# Altium project PhotodiodeBoard.PrjPCB
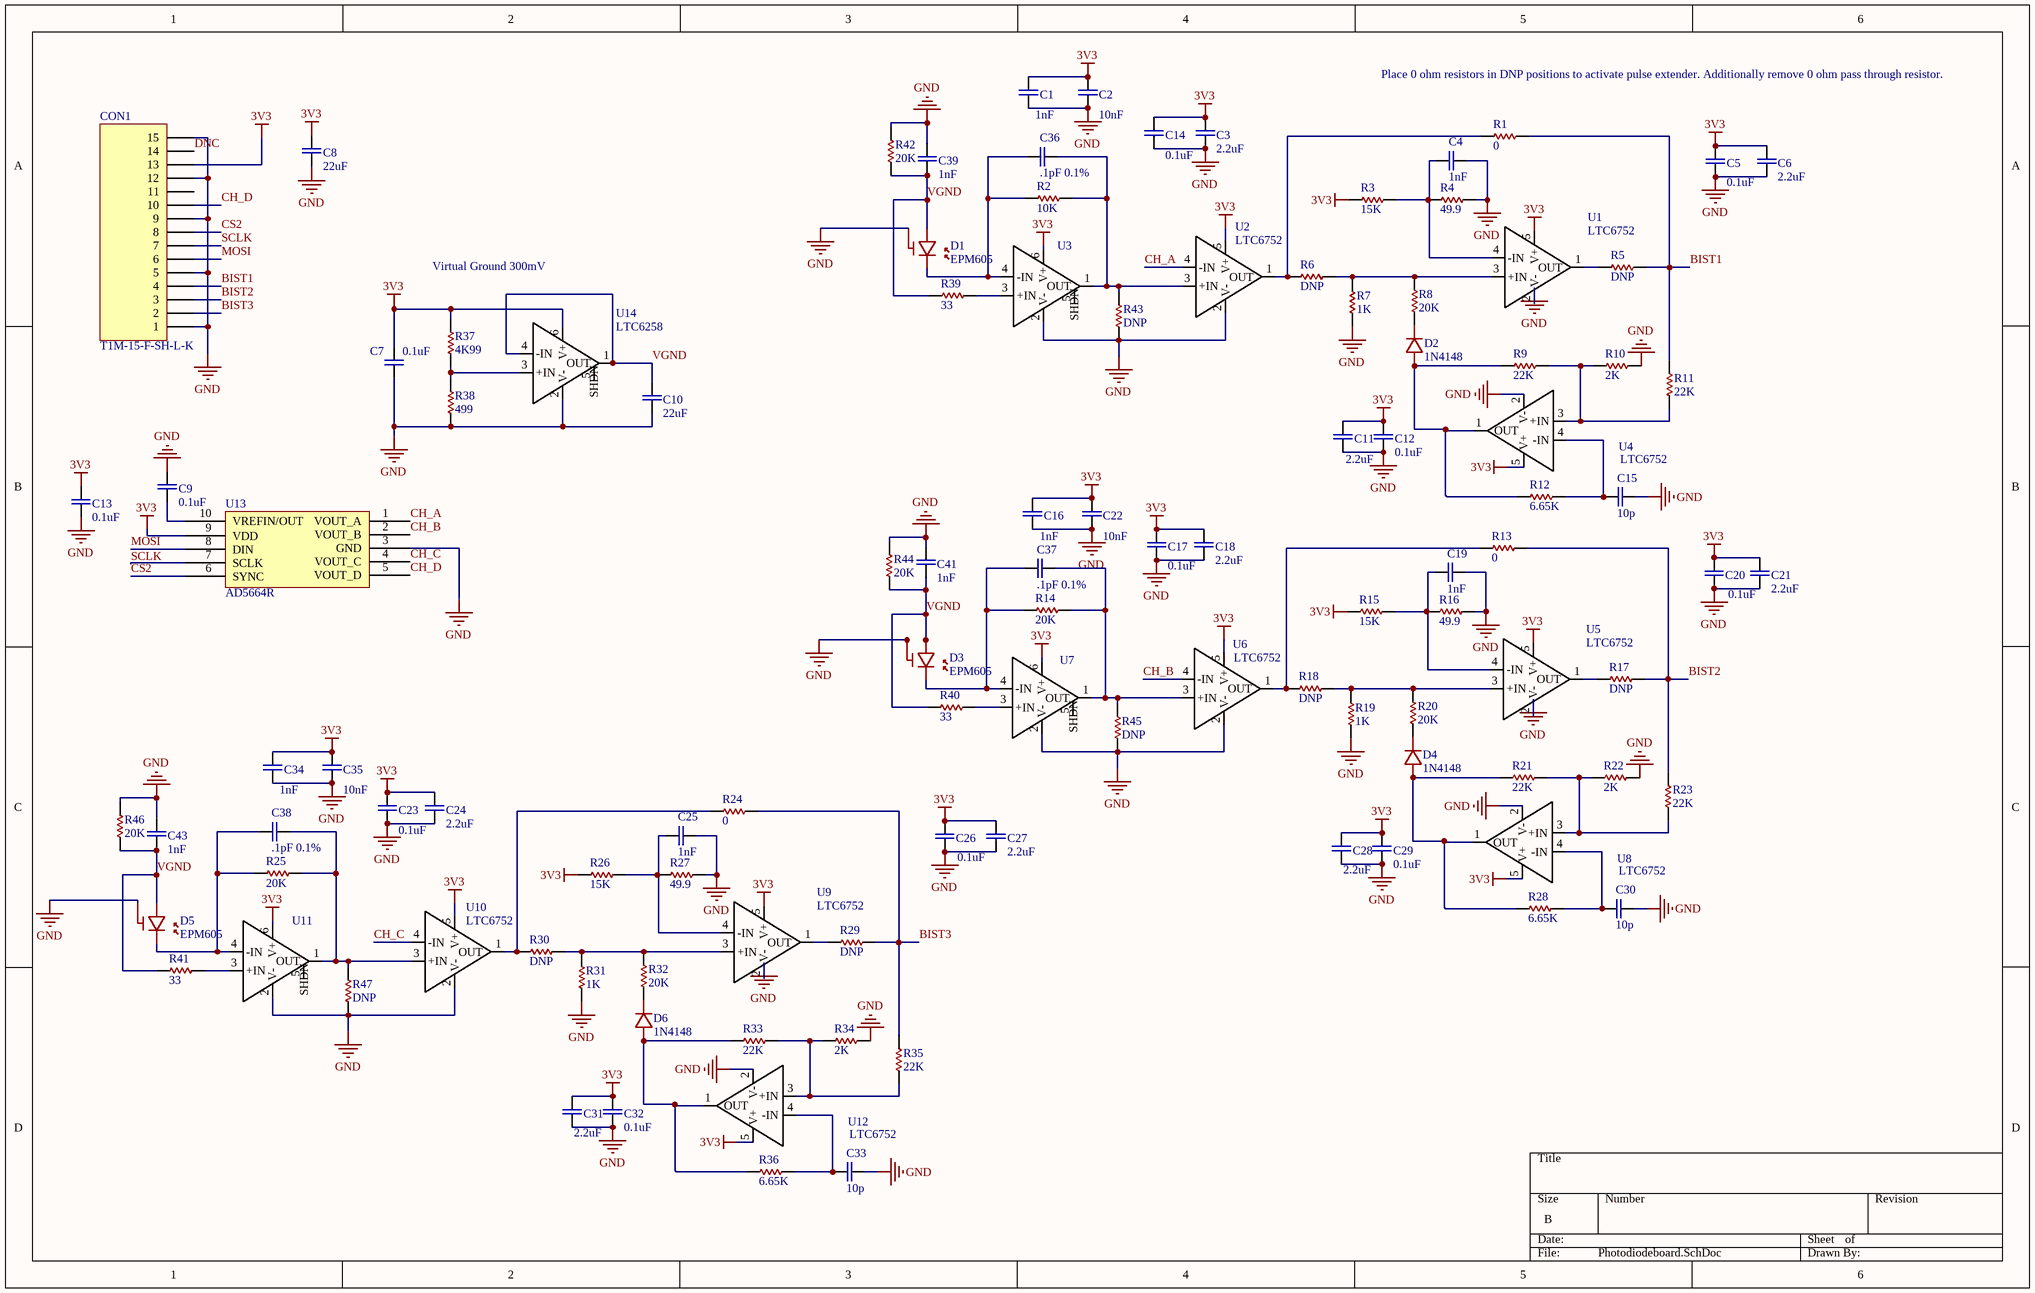
[diagram p0: Photodiodeboard.SchDoc]
1 sheet, 109 parts. Net scope: global (net labels, ports and power ports of the same name join across sheets).
Board file: PhotodiodeBoard.PcbDoc

## Sheet Photodiodeboard.SchDoc
size B

### Parts
C1  1nF  [0402]
C2  10nF  [0402]
C3  2.2uF  [0402]
C4  1nF  [0402]
C5  0.1uF  [0402]
C6  2.2uF  [0402]
C7  0.1uF  [0402]
C8  22uF  [0603]
C9  0.1uF  [0402]
C10  22uF  [0603]
C11  2.2uF  [0402]
C12  0.1uF  [0402]
C13  0.1uF  [0402]
C14  0.1uF  [0402]
C15  10p  [0402]
C16  1nF  [0402]
C17  0.1uF  [0402]
C18  2.2uF  [0402]
C19  1nF  [0402]
C20  0.1uF  [0402]
C21  2.2uF  [0402]
C22  10nF  [0402]
C23  0.1uF  [0402]
C24  2.2uF  [0402]
C25  1nF  [0402]
C26  0.1uF  [0402]
C27  2.2uF  [0402]
C28  2.2uF  [0402]
C29  0.1uF  [0402]
C30  10p  [0402]
C31  2.2uF  [0402]
C32  0.1uF  [0402]
C33  10p  [0402]
C34  1nF  [0402]
C35  10nF  [0402]
C36  .1pF 0.1%  [0402]
C37  .1pF 0.1%  [0402]
C38  .1pF 0.1%  [0402]
C39  1nF  [0402]
C41  1nF  [0402]
C43  1nF  [0402]
CON1  T1M-15-F-SH-L-K  [T1M-15-F-SH-L-K]
D1  EPM605  [EPM605]
D2  1N4148  [SOD123FL]
D3  EPM605  [EPM605]
D4  1N4148  [SOD123FL]
D5  EPM605  [EPM605]
D6  1N4148  [SOD123FL]
R1  0  [0402]
R2  10K  [0402]
R3  15K  [0402]
R4  49.9  [0402]
R5  DNP  [0402]
R6  DNP  [0402]
R7  1K  [0402]
R8  20K  [0402]
R9  22K  [0402]
R10  2K  [0402]
R11  22K  [0402]
R12  6.65K  [0402]
R13  0  [0402]
R14  20K  [0402]
R15  15K  [0402]
R16  49.9  [0402]
R17  DNP  [0402]
R18  DNP  [0402]
R19  1K  [0402]
R20  20K  [0402]
R21  22K  [0402]
R22  2K  [0402]
R23  22K  [0402]
R24  0  [0402]
R25  20K  [0402]
R26  15K  [0402]
R27  49.9  [0402]
R28  6.65K  [0402]
R29  DNP  [0402]
R30  DNP  [0402]
R31  1K  [0402]
R32  20K  [0402]
R33  22K  [0402]
R34  2K  [0402]
R35  22K  [0402]
R36  6.65K  [0402]
R37  4K99  [0402]
R38  499  [0402]
R39  33  [0402]
R40  33  [0402]
R41  33  [0402]
R42  20K  [0402]
R43  DNP  [0402]
R44  20K  [0402]
R45  DNP  [0402]
R46  20K  [0402]
R47  DNP  [0402]
U1  LTC6752  [TSOT-23 5 Lead]
U2  LTC6752  [TSOT-23 5 Lead]
U3  LTC6268-10  [TSOT-23 6 Lead]  (value not drawn)
U4  LTC6752  [TSOT-23 5 Lead]
U5  LTC6752  [TSOT-23 5 Lead]
U6  LTC6752  [TSOT-23 5 Lead]
U7  LTC6268-10  [TSOT-23 6 Lead]  (value not drawn)
U8  LTC6752  [TSOT-23 5 Lead]
U9  LTC6752  [TSOT-23 5 Lead]
U10  LTC6752  [TSOT-23 5 Lead]
U11  LTC6268-10  [TSOT-23 6 Lead]  (value not drawn)
U12  LTC6752  [TSOT-23 5 Lead]
U13  AD5664R  [MSOP-10]
U14  LTC6258  [TSOT-23 6 Lead]

### Nets
3V3: C1.1 C2.1 C3.1 C5.1 C6.1 C7.2 C8.1 C11.1 C12.1 C13.2 C14.1 C16.1 C17.1 C18.1 C20.1 C21.1 C22.1 C23.1 C24.1 C26.1 C27.1 C28.1 C29.1 C31.1 C32.1 C34.1 C35.1 CON1.13 R3.2 R15.2 R26.2 R37.1 U1.5(V+) U2.5(V+) U3.6(V+) U4.5(V+) U5.5(V+) U6.5(V+) U7.6(V+) U8.5(V+) U9.5(V+) U10.5(V+) U11.6(V+) U12.5(V+) U13.9(VDD) U14.6(V+)
GND: C1.2 C2.2 C3.2 C4.2 C5.2 C6.2 C7.1 C8.2 C9.1 C10.2 C11.2 C12.2 C13.1 C14.2 C15.1 C16.2 C17.2 C18.2 C19.2 C20.2 C21.2 C22.2 C23.2 C24.2 C25.2 C26.2 C27.2 C28.2 C29.2 C30.1 C31.2 C32.2 C33.1 C34.2 C35.2 C39.2 C41.2 C43.2 CON1.1 CON1.5 CON1.9 CON1.12 CON1.15 D1.3 D3.3 D5.3 R4.1 R7.2 R10.1 R16.1 R19.2 R22.1 R27.1 R31.2 R34.1 R38.2 R42.2 R43.2 R44.2 R45.2 R46.2 R47.2 U1.2(V-) U2.2(V-) U3.2(V-) U4.2(V-) U5.2(V-) U6.2(V-) U7.2(V-) U8.2(V-) U9.2(V-) U10.2(V-) U11.2(V-) U12.2(V-) U13.3(GND) U14.2(V-)
BIST1: CON1.4 R1.1 R5.1 R11.1
BIST2: CON1.3 R13.1 R17.1 R23.1
BIST3: CON1.2 R24.1 R29.1 R35.1
CH_A: U2.4(-IN) U13.1(VOUT_A)
CH_B: U6.4(-IN) U13.2(VOUT_B)
CH_C: U10.4(-IN) U13.4(VOUT_C)
CH_D: CON1.10 U13.5(VOUT_D)
CS2: CON1.8 U13.6(SYNC)
DNC: CON1.14
MOSI: CON1.6 U13.8(DIN)
SCLK: CON1.7 U13.7(SCLK)
VGND: C10.1 C39.1 C41.1 C43.1 D1.1 D3.1 D5.1 R39.2 R40.2 R41.2 R42.1 R44.1 R46.1 U14.1(OUT) U14.4(-IN)
NetC4_1: C4.1 R3.1 R4.2 U1.4(-IN)
NetC9_2: C9.2 U13.10(VREFIN/OUT)
NetC15_2: C15.2 R12.1 U4.4(-IN)
NetC19_1: C19.1 R15.1 R16.2 U5.4(-IN)
NetC25_1: C25.1 R26.1 R27.2 U9.4(-IN)
NetC30_2: C30.2 R28.1 U8.4(-IN)
NetC33_2: C33.2 R36.1 U12.4(-IN)
NetC36_1: C36.1 D1.2 R2.2 U3.4(-IN)
NetC36_2: C36.2 R2.1 R43.1 U2.3(+IN) U3.1(OUT)
NetC37_1: C37.1 D3.2 R14.2 U7.4(-IN)
NetC37_2: C37.2 R14.1 R45.1 U6.3(+IN) U7.1(OUT)
NetC38_1: C38.1 D5.2 R25.2 U11.4(-IN)
NetC38_2: C38.2 R25.1 R47.1 U10.3(+IN) U11.1(OUT)
NetD2_1: D2.1 R9.2 R12.2 U4.1(OUT)
NetD2_2: D2.2 R8.1
NetD4_1: D4.1 R21.2 R28.2 U8.1(OUT)
NetD4_2: D4.2 R20.1
NetD6_1: D6.1 R33.2 R36.2 U12.1(OUT)
NetD6_2: D6.2 R32.1
NetR1_2: R1.2 R6.2 U2.1(OUT)
NetR5_2: R5.2 U1.1(OUT)
NetR6_1: R6.1 R7.1 R8.2 U1.3(+IN)
NetR9_1: R9.1 R10.2 R11.2 U4.3(+IN)
NetR13_2: R13.2 R18.2 U6.1(OUT)
NetR17_2: R17.2 U5.1(OUT)
NetR18_1: R18.1 R19.1 R20.2 U5.3(+IN)
NetR21_1: R21.1 R22.2 R23.2 U8.3(+IN)
NetR24_2: R24.2 R30.2 U10.1(OUT)
NetR29_2: R29.2 U9.1(OUT)
NetR30_1: R30.1 R31.1 R32.2 U9.3(+IN)
NetR33_1: R33.1 R34.2 R35.2 U12.3(+IN)
NetR37_2: R37.2 R38.1 U14.3(+IN)
NetR39_1: R39.1 U3.3(+IN)
NetR40_1: R40.1 U7.3(+IN)
NetR41_1: R41.1 U11.3(+IN)

Not connected (* = marked no-connect by the designer): CON1 11; U3 5(SHDN); U7 5(SHDN); U11 5(SHDN); U14 5(SHDN)

### Notes on the sheet
- Place 0 ohm resistors in DNP positions to activate pulse extender. Additionally remove 0 ohm pass through resistor.
- Virtual Ground 300mV

### Library data of the parts
C1-C7 C9 C11-C37 C39 C41 C43 = Cap 0402
C8 C10 = Cap 0603
C38 = Cap 0402: .1pF
D2 D4 D6 = 1N4148: Fast switching diode SMD
R1-R4 R7-R16 R19-R28 R31-R38 R42 R44 R46 = Res 0402
R5 R6 R17 R18 R29 R30 = Res 0402: 0 ohm
R39-R41 = Res 0402: 33 ohm
R43 R45 R47 = Res 0402: 50 ohm